# Altium project RN2483.PrjPcb
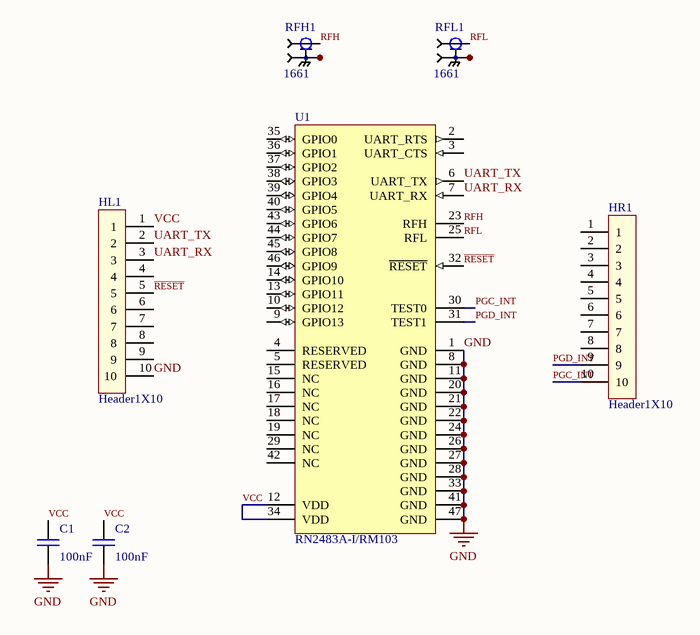
[diagram p0: RN2483A.SchDoc]
1 sheet, 7 parts. Net scope: global (net labels, ports and power ports of the same name join across sheets).
Board file: RN2483A.PcbDoc

## Sheet RN2483A.SchDoc: Project
size A4; Organization: Bjørn Brodtkorb; Address1: Frode Rinnans veg 161; Address2: 7050 Trondheim; DocumentNumber: 6598; Revision: 1.0; SheetNumber: 1; SheetTotal: 1

### Parts
C1  value 100nF  [C0603]  (hidden comment: 02016D104KAT2A)
C2  value 100nF  [C0603]  (hidden comment: 02016D104KAT2A)
HL1  Header1X10  [Header1X10]
HR1  Header1X10  [Header1X10]
RFH1  1661  [*MOLEX_1661]
RFL1  1661  [*MOLEX_1661]
U1  RN2483A-I/RM103  [MCHP-MODULE-47_V]

### Nets
GND: C1.1 C2.1 HL1.10 U1.1(GND) U1.8(GND) U1.11(GND) U1.20(GND) U1.21(GND) U1.22(GND) U1.24(GND) U1.26(GND) U1.27(GND) U1.28(GND) U1.33(GND) U1.41(GND) U1.47(GND)
PGC_INT: HR1.10 U1.30(TEST0)
PGD_INT: HR1.9 U1.31(TEST1)
~{RESET}: HL1.5 U1.32(~{RESET})
RFH: RFH1.1(SIG) U1.23(RFH)
RFL: RFL1.1(SIG) U1.25(RFL)
UART_RX: HL1.3 U1.7(UART_RX)
UART_TX: HL1.2 U1.6(UART_TX)
VCC: C1.2 C2.2 HL1.1 U1.12(VDD) U1.34(VDD)
NetRFH1_2: RFH1.2(GND) RFH1.3(GND) RFH1.4(GND)
NetRFL1_2: RFL1.2(GND) RFL1.3(GND) RFL1.4(GND)

Not connected (* = marked no-connect by the designer): HL1 4 6 7 8 9; HR1 1 2 3 4 5 6 7 8; U1 2(UART_RTS) 3(UART_CTS) 4(RESERVED) 5(RESERVED) 9(GPIO13) 10(GPIO12) 13(GPIO11) 14(GPIO10) 15(NC) 16(NC) 17(NC) 18(NC) 19(NC) 29(NC) 35(GPIO0) 36(GPIO1) 37(GPIO2) 38(GPIO3) 39(GPIO4) 40(GPIO5) 42(NC) 43(GPIO6) 44(GPIO7) 45(GPIO8) 46(GPIO9)

### Notes on the sheet
- Title
- Size:
- Date:
- A4
- Number:
- Time:
- Revision:
- Sheet
- of
- File:

### Library data of the parts
C1 C2 = 02016D104KAT2A: C0603
RFH1 RFL1 = 1661: uFL SMT Antenna Connector; MF: Keystone Electronics; Price: None; MP: 1661; Availability: Unavailable; SnapEDA_Link: https://www.snapeda.com/parts/1661/Keystone%20Electronics/view-part/?ref=snap; Package: None; Value: *
U1 = CMP-2000-07478-1: Low-Power Long Range LoRa(R) Technology Transceiver Module, 2.1 to 3.6 V, -40 to 85 degC, 47-Pin SMD, RoHS, Tray; Manufacturer: Microchip; Datasheet URL: http://www.microchip.com/mymicrochip/filehandler.aspx?ddocname=en574289; Package Description: 47-Pin Surface Mount Device, Body 26.67 x 17.78 mm, Pitch 1.27 mm; Package Reference: MODULE-47; RoHSCompliant: false; Mounting Technology: SurfaceMount; Datasheet Version: Rev. C, 04/2017; Manufacturer URL: http://www.microchip.com/